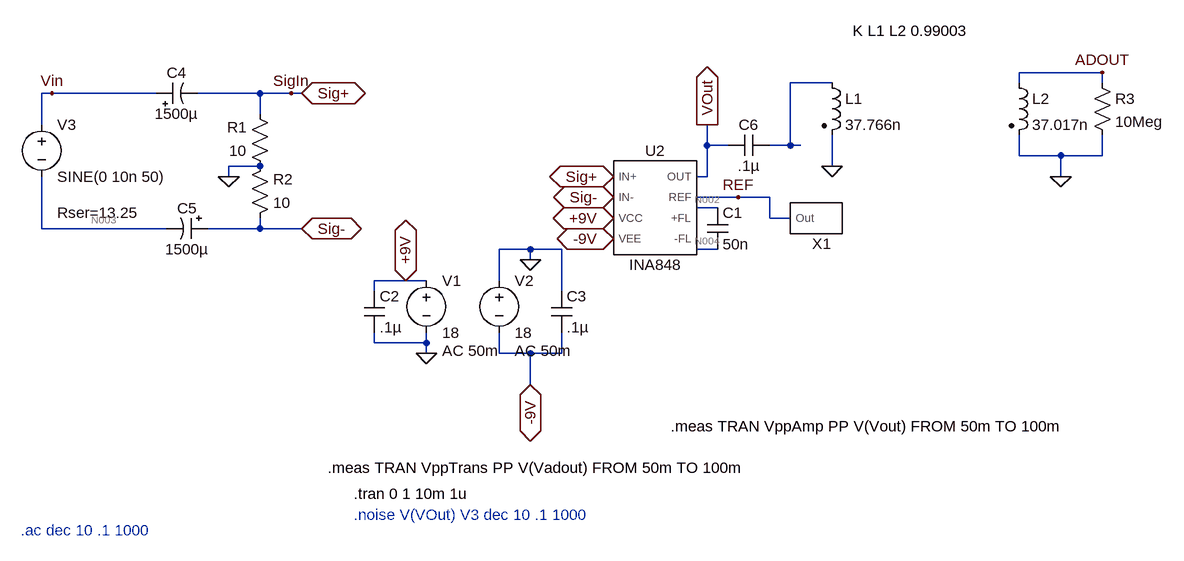
[diagram p0: schematic Amplifier.asc]
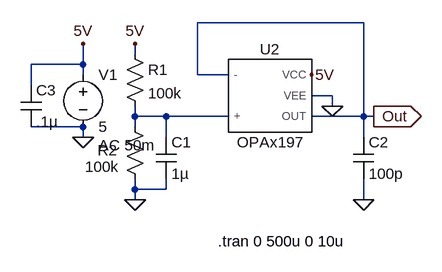
[diagram p1: sub-circuit refamp197.asc]
Amplifier.asc, the LTspice schematic file:
Version 4
SHEET 1 1204 680
WIRE 944 -48 816 -48
WIRE 528 -32 464 -32
WIRE 816 -32 816 -48
WIRE 944 -32 944 -48
WIRE -672 -16 -688 -16
WIRE -512 -16 -672 -16
WIRE -352 -16 -448 -16
WIRE -304 -16 -352 -16
WIRE -288 -16 -304 -16
WIRE -352 16 -352 -16
WIRE -688 32 -688 -16
WIRE 336 64 336 32
WIRE 368 64 336 64
WIRE 464 64 464 -32
WIRE 464 64 432 64
WIRE 480 64 464 64
WIRE 816 80 816 48
WIRE 880 80 816 80
WIRE 944 80 944 48
WIRE 944 80 880 80
WIRE -352 96 -400 96
WIRE 528 96 528 48
WIRE -400 112 -400 96
WIRE 336 112 336 64
WIRE 336 112 320 112
WIRE 880 112 880 80
WIRE 384 144 320 144
WIRE 432 144 384 144
WIRE 352 160 320 160
WIRE 320 176 320 160
WIRE 432 176 432 144
WIRE 464 176 432 176
WIRE -688 192 -688 112
WIRE -496 192 -688 192
WIRE -352 192 -352 176
WIRE -352 192 -432 192
WIRE -288 192 -352 192
WIRE 64 224 16 224
WIRE 112 224 64 224
WIRE 320 224 320 208
WIRE 352 224 320 224
WIRE 64 240 64 224
WIRE -128 272 -176 272
WIRE -96 272 -128 272
WIRE 16 272 16 224
WIRE -176 288 -176 272
WIRE 112 288 112 224
WIRE -176 368 -176 352
WIRE -96 368 -96 352
WIRE -96 368 -176 368
WIRE -96 384 -96 368
WIRE 16 384 16 352
WIRE 64 384 16 384
WIRE 112 384 112 352
WIRE 112 384 64 384
WIRE 64 432 64 384
FLAG -96 384 0
FLAG 64 240 0
FLAG -128 272 +9V
IOPIN -128 272 BiDir
FLAG 64 432 -9V
IOPIN 64 432 BiDir
FLAG 192 176 +9V
IOPIN 192 176 BiDir
FLAG 192 208 -9V
IOPIN 192 208 BiDir
FLAG -288 -16 Sig+
IOPIN -288 -16 BiDir
FLAG 192 112 Sig+
IOPIN 192 112 BiDir
FLAG -288 192 Sig-
IOPIN -288 192 BiDir
FLAG 192 144 Sig-
IOPIN 192 144 BiDir
FLAG 336 32 VOut
IOPIN 336 32 Out
FLAG -400 112 0
FLAG 384 144 REF
FLAG -672 -16 Vin
FLAG -304 -16 SigIn
FLAG 944 -48 ADOUT
FLAG 528 96 0
FLAG 880 112 0
SYMBOL cap 336 160 R0
SYMATTR InstName C1
SYMATTR Value 50n
SYMBOL voltage -96 256 R0
WINDOW 123 24 124 Left 2
WINDOW 39 0 0 Left 0
SYMATTR Value2 AC 50m
SYMATTR InstName V1
SYMATTR Value 18
SYMBOL voltage 16 256 R0
WINDOW 123 24 124 Left 2
WINDOW 39 0 0 Left 0
SYMATTR Value2 AC 50m
SYMATTR InstName V2
SYMATTR Value 18
SYMBOL cap -192 288 R0
SYMATTR InstName C2
SYMATTR Value .1µ
SYMBOL cap 96 288 R0
SYMATTR InstName C3
SYMATTR Value .1µ
SYMBOL voltage -688 16 R0
WINDOW 39 24 152 Left 2
SYMATTR SpiceLine Rser=13.25
SYMATTR Value2 AC 0 0
SYMATTR InstName V3
SYMATTR Value SINE(0 10n 50)
SYMBOL res -336 112 R180
WINDOW 0 36 76 Left 2
WINDOW 3 36 40 Left 2
SYMATTR InstName R1
SYMATTR Value 10
SYMATTR SpiceLine tol=1
SYMBOL res -368 192 M180
WINDOW 0 36 76 Left 2
WINDOW 3 36 40 Left 2
SYMATTR InstName R2
SYMATTR Value 10
SYMATTR SpiceLine tol=1
SYMBOL RefAmp197 512 176 R180
WINDOW 0 0 -24 Bottom 2
SYMATTR InstName X1
SYMBOL polcap -512 0 R270
WINDOW 0 32 32 VTop 2
WINDOW 3 0 32 VBottom 2
SYMATTR InstName C4
SYMATTR Value 1500µ
SYMATTR Description Capacitor
SYMATTR Type cap
SYMATTR SpiceLine V=10 Irms=715m Rser=0.093 Lser=29.9n mfg="Würth Elektronik" pn="860020274017 WCAP-ATG5 8x20" type="Al electrolytic"
SYMBOL polcap -432 176 R90
WINDOW 0 0 32 VBottom 2
WINDOW 3 32 32 VTop 2
SYMATTR InstName C5
SYMATTR Value 1500µ
SYMATTR Description Capacitor
SYMATTR Type cap
SYMATTR SpiceLine V=10 Irms=715m Rser=0.093 Lser=29.9n mfg="Würth Elektronik" pn="860020274017 WCAP-ATG5 8x20" type="Al electrolytic"
SYMBOL INA848 256 160 R0
SYMATTR InstName U2
SYMBOL ind2 512 -48 R0
SYMATTR InstName L1
SYMATTR Value 37.766n
SYMATTR Type ind
SYMATTR SpiceLine Rser=1.3256
SYMBOL ind2 800 -48 R0
SYMATTR InstName L2
SYMATTR Value 37.017n
SYMATTR Type ind
SYMATTR SpiceLine Rser=0.63631
SYMBOL res 928 -48 R0
SYMATTR InstName R3
SYMATTR Value 10Meg
SYMBOL cap 432 48 R90
WINDOW 0 0 32 VBottom 2
WINDOW 3 32 32 VTop 2
SYMATTR InstName C6
SYMATTR Value .1µ
TEXT -208 600 Left 2 !.tran 0 1 10m 1u
TEXT -208 632 Left 2 ;.noise V(VOut) V3 dec 10 .1 1000
TEXT -248 560 Left 2 !.meas TRAN VppTrans PP V(Vadout) FROM 50m TO 100m
TEXT -720 656 Left 2 ;.ac dec 10 .1 1000
TEXT 560 -112 Left 2 !K L1 L2 0.99003
TEXT 280 496 Left 2 !.meas TRAN VppAmp PP V(Vout) FROM 50m TO 100m

refamp197.asc, the sub-circuit schematic file:
Version 4
SHEET 1 880 680
WIRE 432 64 176 64
WIRE 80 112 80 96
WIRE 0 128 0 96
WIRE 0 128 -80 128
WIRE 0 144 0 128
WIRE 176 144 176 64
WIRE 224 144 176 144
WIRE -80 160 -80 128
WIRE 384 176 352 176
WIRE 384 192 384 176
WIRE 80 208 80 192
WIRE 128 208 80 208
WIRE 224 208 128 208
WIRE 432 208 432 64
WIRE 432 208 352 208
WIRE 448 208 432 208
WIRE 0 224 -80 224
WIRE 80 224 80 208
WIRE 0 240 0 224
WIRE 128 240 128 208
WIRE 432 240 432 208
WIRE 80 320 80 304
WIRE 128 320 128 304
WIRE 128 320 80 320
WIRE 80 336 80 320
WIRE 432 336 432 304
FLAG 80 336 0
FLAG 0 240 0
FLAG 0 96 5V
FLAG 80 96 5V
FLAG 352 144 5V
FLAG 432 336 0
FLAG 384 192 0
FLAG 448 208 Out
IOPIN 448 208 Out
SYMBOL voltage 0 128 R0
WINDOW 123 24 124 Left 2
WINDOW 39 0 0 Left 0
SYMATTR Value2 AC 50m
SYMATTR InstName V1
SYMATTR Value 5
SYMBOL res 64 96 R0
SYMATTR InstName R1
SYMATTR Value 100k
SYMBOL res 64 208 R0
WINDOW 0 -42 52 Left 2
WINDOW 3 -61 77 Left 2
SYMATTR InstName R2
SYMATTR Value 100k
SYMBOL cap 112 240 R0
SYMATTR InstName C1
SYMATTR Value 1µ
SYMBOL cap 416 240 R0
SYMATTR InstName C2
SYMATTR Value 100p
SYMBOL cap -96 160 R0
SYMATTR InstName C3
SYMATTR Value .1µ
SYMBOL OPAx197 288 176 R0
SYMATTR InstName U2
TEXT 208 400 Left 2 !.tran 0 500u 0 10u

The netlist it stands for:
* Amplifier.asc
C1 N002 N004 50n
V1 +9V 0 18 AC 50m
V2 0 -9V 18 AC 50m
C2 +9V 0 .1µ
C3 0 -9V .1µ
V3 Vin N003 SINE(0 10n 50) AC 0 0 Rser=13.25
R1 0 SigIn 10 tol=1
R2 Sig- 0 10 tol=1
XX1 REF refamp197
C4 Vin SigIn 1500µ V=10 Irms=715m Rser=0.093 Lser=29.9n mfg="Würth Elektronik" pn="860020274017 WCAP-ATG5 8x20" type="Al electrolytic"
C5 Sig- N003 1500µ V=10 Irms=715m Rser=0.093 Lser=29.9n mfg="Würth Elektronik" pn="860020274017 WCAP-ATG5 8x20" type="Al electrolytic"
XU2 SigIn Sig- +9V -9V VOut REF N002 N004 INA848  ; pins IN+ IN- VCC VEE OUT REF +FL -FL
L1 N001 0 37.766n Rser=1.3256
L2 ADOUT 0 37.017n Rser=0.63631
R3 ADOUT 0 10Meg
C6 N001 VOut .1µ

* block symbol definitions
.subckt refamp197 Out
V1 5V 0 5 AC 50m
R1 5V N001 100k
R2 N001 0 100k
C1 N001 0 1µ
C2 Out 0 100p
C3 5V 0 .1µ
XU2 N001 Out 5V 0 Out OPAx197  ; pins + - VCC VEE OUT
.tran 0 500u 0 10u
.ends refamp197

.tran 0 1 10m 1u
* .noise V(VOut) V3 dec 10 .1 1000
.meas TRAN VppTrans PP V(Vadout) FROM 50m TO 100m
* .ac dec 10 .1 1000
K L1 L2 0.99003
.meas TRAN VppAmp PP V(Vout) FROM 50m TO 100m
.lib C:\Users\bismi\OneDrive\Documents\LTspice\SPICEV2\OPAx197.LIB
.lib C:\Users\bismi\OneDrive\Documents\LTspice\SPICEV2\INA848.LIB
.backanno
.end

* Results of the author's LTspice run, read from the files saved beside the schematic
* Operating Point, zero values left out:
*   V(n002) = 111.4 mV
*   V(n004) = 111.5 mV
*   V(+9v) = 18 V
*   V(-9v) = -18 V
*   V(vin) = -240 nV
*   V(n003) = -240 nV
*   V(sigin) = -250 nV
*   V(sig-) = -230 nV
*   V(ref) = 2.5 V
*   V(vout) = 2.5 V
*   I(R1) = 25 nA
*   I(R2) = -23 nA
*   I(V1) = -6.219 mA
*   I(V2) = -6.238 mA
*   Ix(x1:OUT) = -18.96 µA
*   Ix(u2:IN+) = 25 nA
*   Ix(u2:IN-) = 23 nA
*   Ix(u2:VCC) = 6.219 mA
*   Ix(u2:VEE) = -6.238 mA
*   Ix(u2:REF) = 18.96 µA
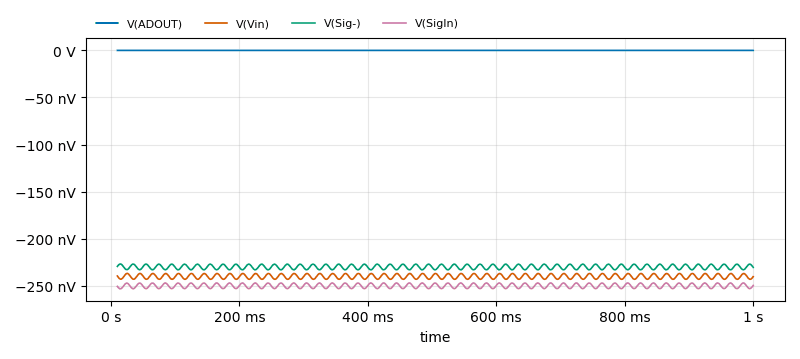
[diagram p2: Transient Analysis of Amplifier.asc, plotted from the saved traces]
* Transient Analysis, 1 run:
*   V(ADOUT): min -35.28 pV, max 30.96 pV, average 519.5 fV, rms 5.097 pV, last 3.168 pV
*   V(Vin): min -243.1 nV, max -236.9 nV, average -240 nV, rms 240 nV, last -240.2 nV
*   V(Sig-): min -233 nV, max -226.8 nV, average -230 nV, rms 230 nV, last -230.4 nV
*   V(SigIn): min -253.2 nV, max -247 nV, average -250 nV, rms 250 nV, last -249.6 nV
* From the log:
*   Measurement "vpptrans" FAIL'ed
*   vppamp: PP(v(vout))=2.36034e-05 FROM 0.05 TO 0.1